# Altium schematic sheet Latch.SchDoc
size A4
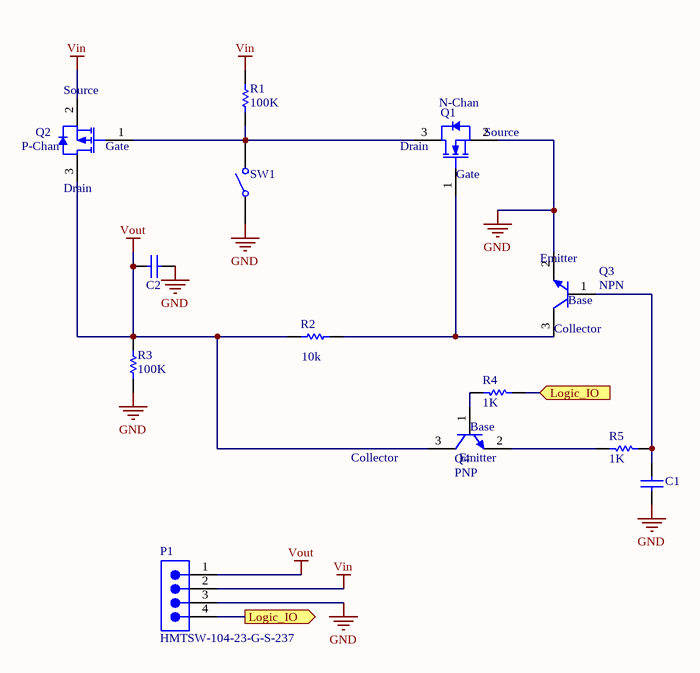
[diagram p0: Latch.SchDoc]

## Parts
C1  CAP 100nF 6.3V 0603(1608)  [CAPC0603(1608)100_L]  (value not drawn)
C2  CAP 100nF 6.3V 0603(1608)  [CAPC0603(1608)100_L]  (value not drawn)
P1  HMTSW-104-23-G-S-237  [SMTC-HMTSW-104-23-X-S-237]
Q1  N-Chan  [ONSC-SOT-23-3-318-08_V]
Q2  P-Chan  [AO-SOT-23-3L_V]
Q3  NPN  [ONSC-SC-70-3-419-04_V]
Q4  PNP  [ONSC-SC-70-3-419-04_V]
R1  100K  [RESC0603(1608)_N]
R2  10k  [RESC1609X55X30LL10T20]
R3  100K  [RESC0603(1608)_N]
R4  1K  [RESC0603(1608)_L]
R5  1K  [RESC0603(1608)_L]
SW1  434121025816  [434121025816]  (value not drawn)

## Ports
Logic_IO (in), Logic_IO (out)

## Nets
GND: C1.1 C2.1 P1.3 Q1.2(S) Q3.2(E) R3.1 SW1.1
Vin: P1.2 Q2.2(SOURCE) R1.2
Vout: C2.2 P1.1 Q2.3(DRAIN) Q4.3(C) R2.1 R3.2
Logic_IO: P1.4 R4.1 ; port Logic_IO
NetC1_2: C1.2 Q3.1(B) R5.2
NetQ1_1: Q1.1(G) Q3.3(C) R2.2
NetQ1_3: Q1.3(D) Q2.1(GATE) R1.1 SW1.2
NetQ4_1: Q4.1(B) R4.2
NetQ4_2: Q4.2(E) R5.1

## Notes on the sheet
- (near Q2) Source
- (near Q2) Gate
- (near Q1) Drain
- (near Q1) Gate
- (near Q1) Source
- (near Q2) Drain
- (near Q3) Emitter
- (near Q3) Base
- (near Q3) Collector
- (near Q4) Collector
- (near Q4) Base
- (near Q4) Emitter

## Library data of the parts
C1 C2 = CMP-1035-02577-1: CAP 100nF 6.3V ±20% 0603 (1608 Metric) Thickness 1mm SMD; Case-EIA: 0603; Case-Metric: 1608; Tolerance: Â±20%; Technology: SMT; Rated Voltage: 6.3 V; Value: 100nF; Max Thickness: 1 mm
P1 = CMP-1024-00023-1: Modified .025" SQ Post Header, Through-hole, Vertical, -55 to 125 degC, 2.54 mm Pitch, 4-Pin, Male, RoHS; Manufacturer: Samtec; Pitch: 2.54 mm; PartNumber: HMTSW-104-23-G-S-237; ComponentLink2URL: http://www.samtec.com/documents/webfiles/pdf/HMTSW.PDF; PackageDescription: Assembly .025 [.64] SQ. Post Hi-Temp Terminal Strip; RoHS: True; ComponentLink1URL: http://www.samtec.com; Mounting Technology: Through-hole; ComponentLink3Description: Package Specification; PackageVersion: AL, 3/1987; PackageReference: HMTSW-104-23-X-S-237; ComponentLink3URL: http://www.samtec.com/documents/webfiles/cpdf/HMTSW-XXX-XX-X-X-XXXX-XX-XX-MKT1.pdf; ComponentLink1Description: Manufacturer URL; Orientation: Vertical; Temperature Range: -55 to 125 degC; DatasheetVersion: F-214; ComponentLink2Description: Datasheet
Q1 = CMP-1058-00775-1: MGSF2N02ELT1G Power MOSFET, 2.8 A, 20 V, N-Channel, 3-Pin SOT-23, Pb-Free, Tape and Reel; Manufacturer: On Semiconductor; Crss Typ (pF): 45; Configuration: Single; V(BR)DSS Min (V): 20; ID Max (A): 2.8; Channel Polarity: N Channel; Ciss Typ (pF): 150; PD Max (W): 1.25; VGS Max (V): 8; Qrr Typ (nC): 200; Coss Typ (pF): 130; VGS(th) Max (V): 1; PartNumber: MGSF2N02ELT1G; ComponentLink3Description: Package Specification; ComponentLink1URL: http://www.onsemi.com/; ComponentLink3URL: http://www.onsemi.cn/pub_link/Collateral/318-08.PDF; DatasheetVersion: Rev. 3; Mounting Technology: Surface Mount; PackageVersion: Rev. AP, 11/2009; PackageDescription: 3-Pin Small Outline Transistor, Body 2.92 x 1.3 mm, Pitch 0.95 mm; ComponentLink1Description: Manufacturer URL; ComponentLink2URL: http://www.onsemi.cn/pub_link/Collateral/MGSF2N02EL-D.PDF; RoHS: Pb-Free; ComponentLink2Description: Datasheet; PackageReference: SOT-23-3-318-08; Package Type: SOT-23-3; Packing: Tape and Reel
Q2 = CMP-2000-05778-1: AO3401A P-Channel MOSFET, 30 V, 4 A, -55 to 150 degC, 3-Pin SOT-23-3L, RoHS, Tape and Reel; Manufacturer: Alpha and Omega; Output Power (Max): NotRequiredW; Power Dissipation: 1.4W; Rad Hardened: No; Drain Efficiency: NotRequired%; Drain-Source On-Volt: 30V; Noise Figure: NotRequireddB; Frequency (Max): NotRequiredMHz; Number of  Elements: 1; Gate-Source Voltage (Max): ?12V; Drain Current (Max): 4A; Channel Mode: Enhancement; Drain-Source On-Res: 0.044ohm; Type: PowerMOSFET; Polarity: P; Package URL: http://www.aosmd.com/res/packaging_information/SOT-23-3L.pdf; Datasheet URL: http://www.aosmd.com/res/data_sheets/AO3401A.pdf; Package Type: SOT-23; Package Description: 3-Pin Small Outline Transistor, Body 2.95 x 1.6 mm, Pitch 0.95 mm; Mounting: SurfaceMount; Manufacturer URL: http://www.aosmd.com/; Continuous Drain Current: 4A; Package Reference: SOT-23-3L; Mounting Technology: SurfaceMount; Operating Temperature Classification: Military; Power Gain: NotRequireddB; Datasheet Version: Rev. 3, 03/2011; Operating Temp Range: -55Cto150C; Pin Count: 3
Q3 = CMP-1048-00379-1: SMMBT2222AWT1GGeneral Purpose Transistor, NPN Silicon, 3-Pin SC70, Pb-Free, Tape and Reel; Manufacturer: On Semiconductor; fT Min (MHz): 300; IC Continuous (A): 0.6; PartNumber: SMMBT2222AWT1G; ComponentLink1Description: Manufacturer URL; Packing: Tape and Reel; ComponentLink1URL: http://www.onsemi.com/; ComponentLink3Description: Package Specification; ComponentLink3URL: http://www.onsemi.cn/pub_link/Collateral/419-04.PDF; DatasheetVersion: Rev. 6; ComponentLink2URL: http://www.onsemi.cn/pub_link/Collateral/MMBT2222AWT1-D.PDF; PackageReference: SC-70-3-419-04; Polarity: NPN; Mounting Technology: Surface Mount; PackageVersion: Rev. N, 11/2008; PackageDescription: 3-Pin Small Outline Transistor, Body 2 x 1.25 mm, Pitch 0.65 mm; ComponentLink2Description: Datasheet; RoHS: TRUE
Q4 = CMP-1048-00366-1: MMBT3906WT1 General Purpose Transistor, PNP Silicon, 3-Pin SC70, Tape and Reel; Manufacturer: On Semiconductor; fT Min (MHz): 250; IC Continuous (A): -0.2; Mounting Technology: Surface Mount; ComponentLink2URL: http://www.onsemi.cn/pub_link/Collateral/MMBT3904WT1-D.PDF; PackageVersion: Rev. N, 11/2008; Packing: Tape and Reel; PartNumber: MMBT3906WT1; ComponentLink3URL: http://www.onsemi.cn/pub_link/Collateral/419-04.PDF; PackageDescription: 3-Pin Small Outline Transistor, Body 2 x 1.25 mm, Pitch 0.65 mm; ComponentLink1Description: Manufacturer URL; PackageReference: SC-70-3-419-04; ComponentLink3Description: Package Specification; ComponentLink2Description: Datasheet; ComponentLink1URL: http://www.onsemi.com/; Polarity: PNP; RoHS: FALSE; DatasheetVersion: Rev. 8
R1 R3 = CMP-1012-00736-1: 100K 0.1W 1% 0603 (1608 Metric)  SMD; Value: 100000.00 Ohm; Case-Metric: 1608; Case-EIA: 0603; Power: 0.1 W; Tolerance: 1 %; Technology: SMT
R2 = CMP-1666-00005-1: 10kΩ 1%CRCW060310K0FKEA; ComponentLink1Description: Datasheet; ComponentLink1URL: http://www.vishay.com/docs/20043/crcwhpe3.pdf; PartNumber: CRCW060310K0FKEA; PackageReference: 0603
R4 R5 = CMP-1012-00074-1: 1K 0.1W 5% 0603 (1608 Metric)  SMD; Case-EIA: 0603; Case-Metric: 1608; Value: 1000.00 Ohm; Technology: SMT; Tolerance: 5 %; Power: 0.1 W
SW1 = CMP-1459-00004-1: WS-TASV SMD Tact Switch 6.0X3.8 mm; Manufacturer: Wuerth Elektronik; NoPins: 02; PackageReference: 434121025816; ComponentLink2URL: http://katalog.we-online.de/em/datasheet/434121025816.pdf; PartNumber: 434121025816; ComponentLink2Description: Datasheet; ComponentLink1URL: http://www.we-online.com; ComponentLink1Description: Manufacturer URL